# Altium schematic sheet Test.SchDoc
size A4; DocumentNumber: 1; Revision: 0.1; SheetNumber: 1; SheetTotal: 1; HTL_Gruppe: 3; HTL_Klasse: 2AHEL; HTL_Schueler_Name: Lisa Karbon & Philipp Dona; PageSetup: Record=PageOptions|CenterHorizontal=True|CenterVertical=True|PrintScale=1.00|XCorrection=1.00|YCorrection=1.00|PrintKind=0|BorderSize=5000000|LeftOffset=0|BottomOffset=0|Orientation=2|PaperLength=1000|PaperWidth=1000|Scale=100|PaperSource=7|PrintQuality=-4|MediaType=1|DitherType=10|PaperKind=A4|PrintScaleMode=1; HTL_Projektname: Digitaler Würfel; HTL_Dokumentenart: Schematic; HTL_Dokumentenstatus: Entwurf; SPICEModelCacheRWURBHBP: <root> / <DocumentId>RWURBHBP</DocumentId> / <CacheFrame Number="0"> / <Model Name="sn74ls00" Kind="MDL"> / <Text>*Texas Instruments / *SN74LS00: LS 2-in NAND / .MODEL SN74LS00 xsimcode(file="{MODEL_PATH}LS.SCB" func=ls00 {mntymx})</Text> / </Model> / </CacheFrame> / </root>
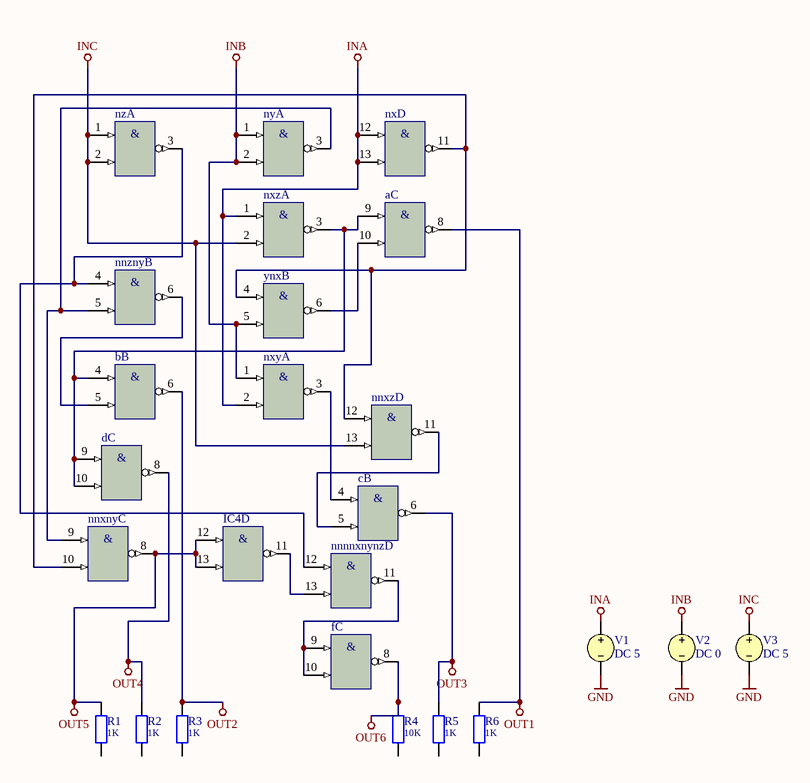
[diagram p0: Test.SchDoc]

## Parts
a  SN74LS00  [DIP14]  (value not drawn)  (part C of 4)
b  SN74LS00  [DIP14]  (value not drawn)  (part B of 4)
c  SN74LS00  [DIP14]  (value not drawn)  (part B of 4)
d  SN74LS00  [DIP14]  (value not drawn)  (part C of 4)
f  SN74LS00  [DIP14]  (value not drawn)  (part C of 4)
IC4  SN74LS00  [DIP14]  (value not drawn)  (part D of 4)
nnnnxnynz  SN74LS00  [DIP14]  (value not drawn)  (part D of 4)
nnxny  SN74LS00  [DIP14]  (value not drawn)  (part C of 4)
nnxz  SN74LS00  [DIP14]  (value not drawn)  (part D of 4)
nnzny  SN74LS00  [DIP14]  (value not drawn)  (part B of 4)
nx  SN74LS00  [DIP14]  (value not drawn)  (part D of 4)
nxy  SN74LS00  [DIP14]  (value not drawn)  (part A of 4)
nxz  SN74LS00  [DIP14]  (value not drawn)  (part A of 4)
ny  SN74LS00  [DIP14]  (value not drawn)  (part A of 4)
nz  SN74LS00  [DIP14]  (value not drawn)  (part A of 4)
R1  1K  [R_0207/RM4]
R2  1K  [R_0207/RM4]
R3  1K  [R_0207/RM4]
R4  10K  [R_0207/RM4]
R5  1K  [R_0207/RM4]
R6  1K  [R_0207/RM4]
V1  DC 5
V2  DC 0
V3  DC 5
ynx  SN74LS00  [DIP14]  (value not drawn)  (part B of 4)

## Nets
GND: a.7(GND) b.7(GND) c.7(GND) d.7(GND) f.7(GND) IC4.7(GND) nnnnxnynz.7(GND) nnxny.7(GND) nnxz.7(GND) nnzny.7(GND) nx.7(GND) nxy.7(GND) nxz.7(GND) ny.7(GND) nz.7(GND) V1.2 V2.2 V3.2 ynx.7(GND)
INA: nx.12(A) nx.13(B) nxy.2(B) nxz.1(A) V1.1
INB: nxy.1(A) ny.1(A) ny.2(B) V2.1 ynx.5(B)
INC: nnxz.13(B) nxz.2(B) nz.1(A) nz.2(B) V3.1
OUT1: a.8(Y) R6.1
OUT2: b.6(Y) R3.1
OUT3: c.6(Y) R5.1
OUT4: d.8(Y) R2.1
OUT5: IC4.12(A) IC4.13(B) nnxny.8(Y) R1.1
OUT6: f.8(Y) R4.1
VCC: a.14(VCC) b.14(VCC) c.14(VCC) d.14(VCC) f.14(VCC) IC4.14(VCC) nnnnxnynz.14(VCC) nnxny.14(VCC) nnxz.14(VCC) nnzny.14(VCC) nx.14(VCC) nxy.14(VCC) nxz.14(VCC) ny.14(VCC) nz.14(VCC) ynx.14(VCC)
Neta_9: a.9(A) b.4(A) d.9(A) d.10(B) nxz.3(Y)
Neta_10: a.10(B) ynx.6(Y)
Netb_5: b.5(B) nnzny.6(Y)
Netc_4: c.4(A) nxy.3(Y)
Netc_5: c.5(B) nnxz.11(Y)
Netf_9: f.9(A) f.10(B) nnnnxnynz.11(Y)
NetIC4_11: IC4.11(Y) nnnnxnynz.13(B)
Netnnnnxnynz_12: nnnnxnynz.12(A) nnzny.4(A) nz.3(Y)
Netnnxny_9: nnxny.9(A) nnzny.5(B) ny.3(Y)
Netnnxny_10: nnxny.10(B) nnxz.12(A) nx.11(Y) ynx.4(A)

Not connected (* = marked no-connect by the designer): R1 2; R2 2; R3 2; R4 2; R5 2; R6 2

## Notes on the sheet
- Sachnummer / Dateiname:
- Name:
- Gruppe:
- Klasse:
- Elektronik &
- Technische Informatik
- Anichstraße 26 - 28
- HTBLVA
- Titel:
- Datum:
- Dokumentenart:
- Dokumentenstatus:
- A - 6020 Innsbruck
- Ver.:
- Blatt:
- Blätter:
- (in symbol SN74LS00, part A) &
- (in symbol SN74LS00, part B) &
- (in symbol SN74LS00, part C) &
- (in symbol SN74LS00, part D) &

## Library data of the parts
a b c d f IC4 nnnnxnynz nnxny nnxz nnzny nx nxy nxz ny nz ynx = SN74LS00: Quad 2-Input Positive-NAND Gate; SimulationModellSource: TI Logic Gate 2; Usage: only permitted for non-commercial purposes at HTL I Innsbruck; Published: 21-Feb-2011; LatestRevisionDate: 31-Oct-2012; Publisher: Michael Kupfner
R1-R6 = R: Resistor; Usage: only permitted for non-commercial purposes at HTL I Innsbruck; Published: 21-Feb-2011; LatestRevisionDate: 07-Sep-2019
  R1-R3 R5 R6: Value: 1K
  R4: Value: 10K
V1 V3 = VSRC: Voltage Source; Note: PCB Footprint - Not required; AC Magnitude: 0; Value: 5; Published: 8-Jun-2000; LatestRevisionDate: 17-Jul-2002; LatestRevisionNote: Re-released for DXP Platform.; PackageReference: Not Applicable; Publisher: Altium Limited; AC Phase: 0
V2 = VSRC: Voltage Source; Note: PCB Footprint - Not required; AC Magnitude: 0; Value: 0; Published: 8-Jun-2000; LatestRevisionDate: 17-Jul-2002; LatestRevisionNote: Re-released for DXP Platform.; PackageReference: Not Applicable; Publisher: Altium Limited; AC Phase: 0